# Altium project VI High Side Reference Design.PrjPcb
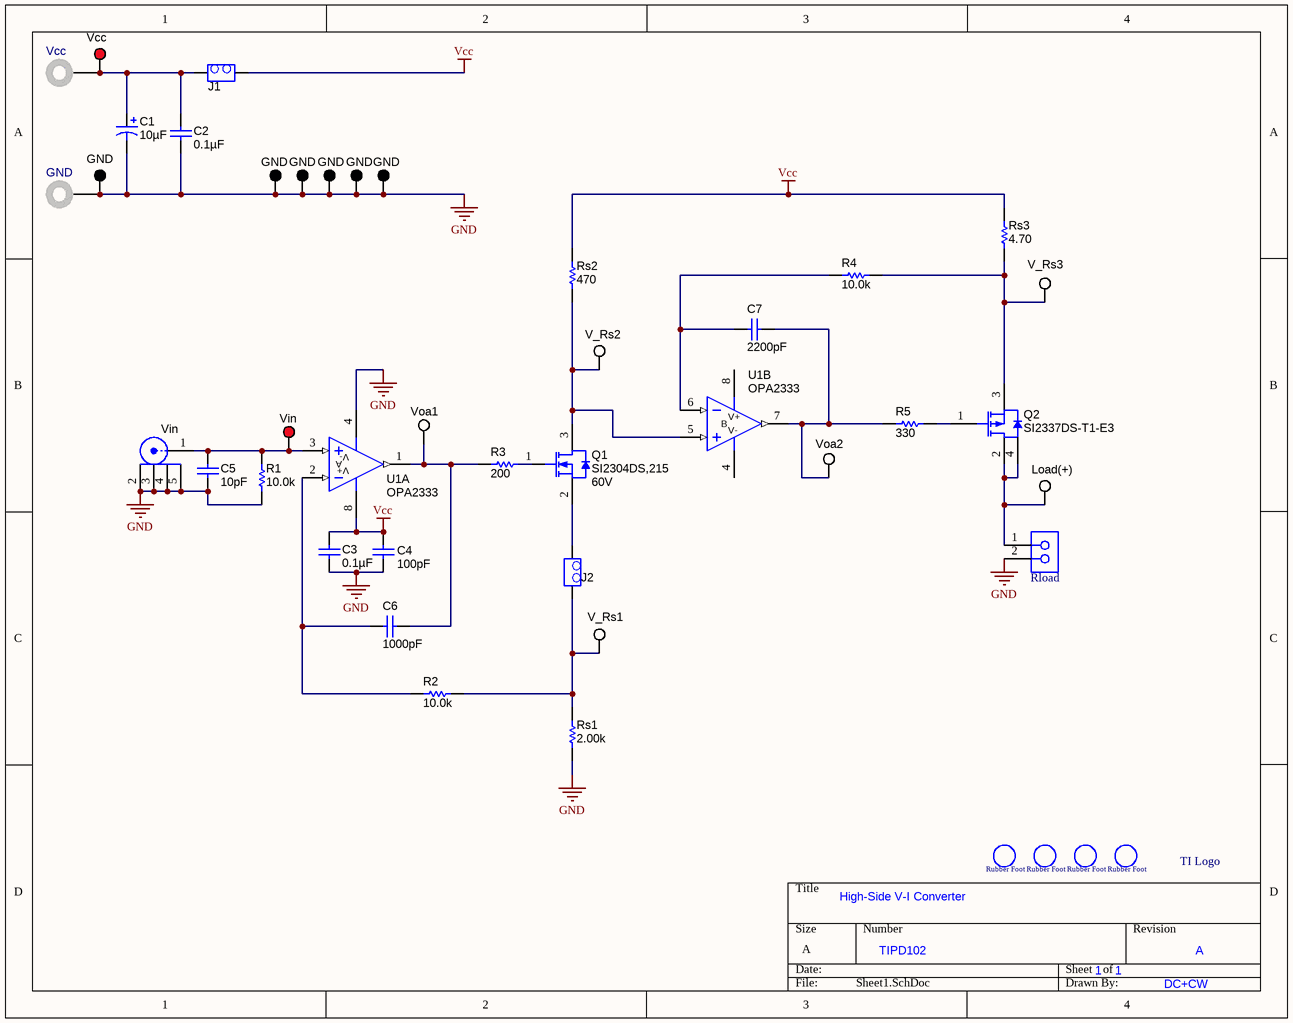
[diagram p0: Sheet1.SchDoc]
1 sheet, 43 parts. Net scope: global (net labels, ports and power ports of the same name join across sheets).
Board file: PCB2.PcbDoc

## Sheet Sheet1.SchDoc: High-Side V-I Converter
size A

### Parts
C1  ValueDisplayed: 10µF  [7343-43]  (hidden comment: TPSE106K050R0400)
C2  ValueDisplayed: 0.1µF  [0603]  (hidden comment: GRM188R72A104KA35D)
C3  ValueDisplayed: 0.1µF  [0603]  (hidden comment: GRM188R72A104KA35D)
C4  ValueDisplayed: 100pF  [0603]  (hidden comment: C1608C0G2A101J)
C5  ValueDisplayed: 10pF  [0603]  (hidden comment: 06035A100JAT2A)
C6  ValueDisplayed: 1000pF  [0603]  (hidden comment: 06031C102JAT2A)
C7  ValueDisplayed: 2200pF  [0603]  (hidden comment: C1608C0G1H222J)
F1  (no value)  [Rubber_Foot]  (no BOM)
F2  (no value)  [Rubber_Foot]  (no BOM)
F3  (no value)  [Rubber_Foot]  (no BOM)
F4  (no value)  [Rubber_Foot]  (no BOM)
GND  575-4  [Keystone_575-4]  (value not drawn)
H1  Vin  [Johnson_142-0701-20x]
J1  TSM-102-01-T-SV  (value not drawn)
J2  TSM-102-01-T-SV  (value not drawn)
Q1  SI2304DS,215  value 60V  [SOT-23]
Q2  SI2337DS-T1-E3  [MP04A_N]
R1  value 10.0k  [0603]  (hidden comment: RG1608P-103-B-T5)
R2  value 10.0k  [0603]  (hidden comment: CRCW060310K0FKEA)
R3  value 200  [0603]  (hidden comment: CRCW0603200RFKEA)
R4  value 10.0k  [0603]  (hidden comment: CRCW060310K0FKEA)
R5  value 330  [0603]  (hidden comment: RC0603FR-07330RL)
Rload  1715721  [PhoenixContact_1715721]  (value not drawn)
Rs1  value 2.00k  [0603]  (hidden comment: RG1608P-202-B-T5)
Rs2  value 470  [0603]  (hidden comment: RGH1608-2C-P-471-B)
Rs3  value 4.70  [0603]  (hidden comment: 8-1614882-3)
TI1  Texas Instruments logo  [TI LOGO]  (value not drawn)
TP1  Vcc  [Keystone5000]
TP2  GND  [Keystone5001]
TP3  GND  [Keystone5001]
TP4  GND  [Keystone5001]
TP5  GND  [Keystone5001]
TP6  GND  [Keystone5001]
TP7  GND  [Keystone5001]
TP8  Vin  [Keystone5000]
TP9  Voa1  [Keystone5002]
TP10  V_Rs2  [Keystone5002]
TP11  V_Rs1  [Keystone5002]
TP12  Voa2  [Keystone5002]
TP13  V_Rs3  [Keystone5002]
TP14  Load(+)  [Keystone5002]
U1  OPA2333  [M08A_L]  (parts A,B of 2)
Vcc  575-4  [Keystone_575-4]  (value not drawn)

### Nets
GND: C1.2(-) C2.2 C3.2 C4.2 C5.2 GND.1 H1.2 H1.3 H1.4 H1.5 R1.1 Rload.2 Rs1.1 TP2.1 TP3.1 TP4.1 TP5.1 TP6.1 TP7.1 U1.4(V-)
Vcc: C3.1 C4.1 J1.2 Rs2.2 Rs3.2 U1.8(V+)
NetC1_1: C1.1(+) C2.1 J1.1 TP1.1 Vcc.1
NetC5_1: C5.1 H1.1 R1.2 TP8.1 U1.3(IN+)
NetC6_1: C6.1 R3.1 TP9.1 U1.1(OUT)
NetC6_2: C6.2 R2.1 U1.2(IN-)
NetC7_1: C7.1 R5.1 TP12.1 U1.7(OUT)
NetC7_2: C7.2 R4.1 U1.6(IN-)
NetJ2_1: J2.1 Q1.2(S)
NetJ2_2: J2.2 R2.2 Rs1.2 TP11.1
NetQ1_1: Q1.1(G) R3.2
NetQ1_3: Q1.3(D) Rs2.1 TP10.1 U1.5(IN+)
NetQ2_1: Q2.1(G) R5.2
NetQ2_2: Q2.2(D) Q2.4(D) Rload.1 TP14.1
NetQ2_3: Q2.3(S) R4.2 Rs3.1 TP13.1

### Notes on the sheet
- (near F1) High-Side V-I Converter
- TIPD102
- 1
- A
- DC+CW
- (in symbol LM6142AIM, part A) A
- (in symbol LM6142AIM, part B) B
- (in symbol SJ61A1) Rubber Foot
- (in symbol TI LOGO) TI Logo

### Library data of the parts
C1 = TPSE106K050R0400: CAP, TANT, 10uF, 50V, +/-10%, 0.4 ohm, 7343-43 SMD; Manufacturer: AVX; Polarized: Y; CompType: Capacitor; U/M: EA; Cap_F: 0.00001; Tolerance_%: 10; Value1: 0.4 ohm; VDC_V: 50; ESR_Ohm: 0.4; IRMS_A: 0.578; TaMin_C: -55; TaMax_C: 125; Cap_Case: E; SymbolVersion: 2008-07-09; Value: 10uF; PartNumber: TPSE106K050R0400; PackageReference: 7343-43; RoHS: Y; Value2: 50V; MountType: SMT; Technology: TA; Series: TPS; Published: 2008-06-19; Publisher: Texas Instruments; LatestRevisionDate: 2012-04-11; LatestRevisionNote: Changed Publisher; ComponentLink1Description: Datasheet link; ComponentLink1URL: http://www.avx.com/docs/masterpubs/tantniob.pdf; Alternate PartNumber: -; Alternate Manufacturer: -; Supplier 1: Digi-Key; Supplier Part Number 1: 478-3361-1-ND; Supplier 2: Farnell; Supplier Part Number 2: 1658990; Supplier 3: Newark; Supplier Part Number 3: 75M2975
C2 C3 = GRM188R72A104KA35D: CAP, CERM, 0.1uF, 100V, +/-10%, X7R, 0603; Manufacturer: MuRata; Polarized: N; CompType: Capacitor; U/M: EA; Cap_F: 0.0000001; Tolerance_%: 10; VDC_V: 100; TaMin_C: -55; TaMax_C: 125; SymbolVersion: 2008-07-09; Value: 0.1uF; PartNumber: GRM188R72A104KA35D; PackageReference: 0603; RoHS: Y; Value1: ?; Value2: 100V; MountType: SMT; Technology: Ceramic; TempCo: X7R; Cap_Case: 0603; Published: 2008-06-19; Publisher: Texas Instruments; LatestRevisionDate: 2012-04-11; LatestRevisionNote: Changed publisher; ComponentLink1Description: Datasheet link; ComponentLink1URL: http://search.murata.co.jp/Ceramy/PnsearchViewAction.do?HnOFG=ON&HnNFG=ON&SEL_CNT=50&sLang=en&sKey=GRM188R72A104KA35D&x=9&y=9&search=startwith; Alternate PartNumber: -; Alternate Manufacturer: -; Supplier 1: Digi-Key; Supplier Part Number 1: 490-3285-1-ND
C4 = C1608C0G2A101J: CAP, CERM, 100pF, 100V, +/-5%, C0G/NP0, 0603; Manufacturer: TDK; Polarized: N; CompType: Capacitor; U/M: EA; Cap_F: 0.0000000001; Tolerance_%: 5; ESR_Ohm: 0.1202; Value1: 0.1202 ohm; VDC_V: 100; TaMin_C: -55; TaMax_C: 125; SymbolVersion: 2008-07-09; Value: 100pF; PartNumber: C1608C0G2A101J; PackageReference: 0603; RoHS: Y; Value2: 100V; MountType: SMT; Technology: Ceramic; TempCo: C0G/NP0; Cap_Case: 0603; Published: 2008-06-19; Publisher: Texas Instruments; LatestRevisionDate: 2012-04-11; LatestRevisionNote: Changed publisher; ComponentLink1Description: Datasheet link; ComponentLink1URL: http://www.tdk.co.jp/tefe02/e412_c.pdf; Alternate PartNumber: -; Alternate Manufacturer: -; Supplier 1: Digi-Key; Supplier Part Number 1: 445-2306-1-ND; Supplier 2: Arrow; Supplier Part Number 2: C1608C0G2A101J
C5 = 06035A100JAT2A: CAP, CERM, 10pF, 50V, +/-5%, C0G/NP0, 0603; Manufacturer: AVX; Polarized: N; CompType: Capacitor; U/M: EA; Cap_F: 0.00000000001; Tolerance_%: 5; ESR_Ohm: 0.403; Value1: 0.403 ohm; VDC_V: 50; TaMin_C: -55; TaMax_C: 125; SymbolVersion: 2008-07-09; Value: 10pF; PartNumber: 06035A100JAT2A; PackageReference: 0603; RoHS: Y; Value2: 50V; MountType: SMT; Technology: Ceramic; TempCo: C0G/NP0; Cap_Case: 0603; Published: 2008-06-19; Publisher: Texas Instruments; LatestRevisionDate: 2012-04-11; LatestRevisionNote: Changed publisher; ComponentLink1Description: Datasheet link; ComponentLink1URL: http://www.avx.com/docs/masterpubs/smccp.pdf; Alternate PartNumber: -; Alternate Manufacturer: -; Supplier 1: Digi-Key; Supplier Part Number 1: 478-1163-1-ND; Supplier 2: Farnell; Supplier Part Number 2: 499110; Supplier 3: Newark; Supplier Part Number 3: 17C6435
C6 = 06031C102JAT2A: CAP, CERM, 1000pF, 100V, +/-5%, X7R, 0603; Manufacturer: AVX; Polarized: N; CompType: Capacitor; U/M: EA; Cap_F: 0.000000001; Tolerance_%: 5; ESR_Ohm: 0.276; Value1: 0.276 ohm; VDC_V: 100; TaMin_C: -55; TaMax_C: 125; SymbolVersion: 2008-07-09; Value: 1000pF; PartNumber: 06031C102JAT2A; PackageReference: 0603; RoHS: Y; Value2: 100V; MountType: SMT; Technology: Ceramic; TempCo: X7R; Cap_Case: 0603; Published: 2008-06-19; Publisher: Texas Instruments; LatestRevisionDate: 2012-04-11; LatestRevisionNote: Changed publisher; ComponentLink1Description: Datasheet link; ComponentLink1URL: http://www.avx.com/docs/masterpubs/smccp.pdf; Alternate PartNumber: -; Alternate Manufacturer: -; Supplier 1: Digi-Key; Supplier Part Number 1: 478-3698-1-ND; Supplier 2: Farnell; Supplier Part Number 2: 1396446; Supplier 3: Newark; Supplier Part Number 3: 96M1234
C7 = C1608C0G1H222J: CAP, CERM, 2200pF, 50V, +/-5%, C0G/NP0, 0603; Manufacturer: TDK; Polarized: N; CompType: Capacitor; U/M: EA; Cap_F: 0.0000000022; Tolerance_%: 5; ESR_Ohm: 0.0375; Value1: 0.0375 ohm; VDC_V: 50; TaMin_C: -55; TaMax_C: 125; SymbolVersion: 2008-07-09; Value: 2200pF; PartNumber: C1608C0G1H222J; PackageReference: 0603; RoHS: Y; Value2: 50V; MountType: SMT; Technology: Ceramic; TempCo: C0G/NP0; Cap_Case: 0603; Published: 2008-06-19; Publisher: Texas Instruments; LatestRevisionDate: 2012-05-14; LatestRevisionNote: Changed publisher; ComponentLink1Description: Datasheet link; ComponentLink1URL: http://www.tdk.co.jp/tefe02/e412_c.pdf; Alternate PartNumber: -; Alternate Manufacturer: -; Supplier 1: Digi-Key; Supplier Part Number 1: 445-1297-1-ND; Supplier 2: Arrow; Supplier Part Number 2: C1608C0G1H222J
F1-F4 = SJ61A1: BUMPON CYLINDRICAL .312X.200 BLK; Manufacturer: 3M; CompType: Rubber Mounting Feet; SymbolCreator: use LDAP id; U/M: EA, IN, or GM; Supplier 1: Digi-Key; Supplier Part Number 1: SJ5746-0-ND; ComponentLink1Description: Datasheet Link; ComponentLink1URL: http://media.digikey.com/pdf/Data%20Sheets/3M%20PDFs/SJ61A1.pdf; MountType: Adhesive - Rubber; PackageReference: *; RoHS: N/A; SymbolVersion: 2012-11-20
GND Vcc = 575-4: Standard Banana Jack, Uninsulated, 5.5mm; Manufacturer: Keystone; CompType: Connector; U/M: EA; PartNumber: 575-4; RoHS: Y; PackageReference: Keystone_575-4; MountType: TH; ComponentLink1Description: Datasheet Link; ComponentLink1URL: http://www.keyelco.com/pdfs/M55p95.pdf; Publisher: National Semiconductor; LatestRevisionDate: 2012-03-04; LatestRevisionNote: Removed DigiKeyPartNumber parameter.; Alternate Manufacturer: -; Alternate PartNumber: -; Supplier 1: Digi-Key; Supplier Part Number 1: 575-4K-ND
H1 = 142-0701-201: Connector, TH, SMA; Manufacturer: Emerson Network Power; U/M: EA; PartNumber: 142-0701-201; CompType: Connector; RoHS: Y; PackageReference: SMA; MountType: TH; ComponentLink1Description: Datasheet Link; ComponentLink1URL: https://emersonconnectivity.com/OA_MEDIA/specs/pi-1420701201.pdf; Publisher: National Semiconductor; LatestRevisionDate: 2012-03-04; LatestRevisionNote: Removed DigiKeyPartNumber parameter.; Alternate Manufacturer: -; Alternate PartNumber: -; Supplier 1: Digi-Key; Supplier Part Number 1: J500-ND
J1 J2 = TSM-102-01-T-SV: CONN HEADER 2POS .100" SNGL SMD; Manufacturer: Samtec; SymbolVersion: use current date i.e. 2008-05-20; SymbolCreator: Use LDAP id; U/M: EA, IN, or GM; MountType: SMT; RoHS: Used in BOM report.  Use Y or N.; PartNumber: TSM-102-01-T-SV; PackageReference: eg:  0603, used in PnP report; ComponentLink1Description: Datasheet Link; ComponentLink1URL: http://www.samtec.com/documents/webfiles/pdf/TSM.PDF; CompType: Header; Alternate PartNumber: -; Alternate Manufacturer: -; Supplier Part Number 1: TSM-102-01-T-SV-ND
Q1 = SI2316BDS-T1-E3: MOSFET, N-CH, 30V, 4.5A, SOT-23; PartNumber: NTF2955T1G; Manufacturer: ON Semi; U/M: EA; ChType: N; Rdson45_Ohm: 0.08; QgTyp_nC: 3.16; IdsMax_A: 4.5; SymbolVersion: 2008-07-28; CompType: MOSFET; PackageReference: SOT-23; RoHS: Y; MountType: SMT; Published: 2008-06-19; LatestRevisionDate: 2012-01-04; LatestRevisionNote: Added parts.; ComponentLink1Description: Datasheet link; Alternate PartNumber: -; Alternate Manufacturer: -; Supplier Part Number 1: NTF2955T1GOSCT-ND
Q2 = SI2337DS-T1-E3: MOSFET, P-CH, -80V, -1.2A, SOT-23; Manufacturer: Vishay-Siliconix; U/M: EA; ChType: P; VdsMax_V: -80; Value1: ? ohm; Value2: 11 nC; QgTyp_nC: 11; Vgs_V: -20; IdsMax_A: -1.2; SymbolVersion: 2008-07-09; Value: -80V; PartNumber: SI2337DS-T1-E3; PackageReference: SOT-23; CompType: MOSFET; RoHS: Y; MountType: SMT; Published: 2008-06-19; Publisher: Texas Instruments; LatestRevisionDate: 2012-01-04; LatestRevisionNote: Added parts.; ComponentLink1Description: Datasheet link; ComponentLink1URL: http://www.vishay.com/docs/73533/si2337ds.pdf; Alternate PartNumber: -; Alternate Manufacturer: -; Supplier 1: Digi-Key; Supplier Part Number 1: SI2337DS-T1-E3CT-ND; Supplier 2: Arrow; Supplier Part Number 2: SI2337DS-T1-E3
R1 = RG1608P-103-B-T5: RES, 10.0k ohm, 0.1%, 0.1W, 0603; Manufacturer: Susumu Co Ltd; CompType: Resistor; Res_ohm: 10000; Value_Code: 10k0; Tolerance_%: 0.1; VDC_V: 75; TempCo: 25 ppm/C; EIA_Code: E192; U/M: EA; SymbolVersion: 2009-05-29; PartNumber: RG1608P-103-B-T5; PackageReference: 0603; RoHS: Y; Value1: 0.1%; Power_W: 0.1; Value2: 0.1W; MountType: SMT; Technology: Metal Film; Published: 2008-06-26; Publisher: Texas Instruments; LatestRevisionDate: 2012-04-20; LatestRevisionNote: Changed publisher; ComponentLink1Description: Datasheet link; ComponentLink1URL: http://www.susumu.co.jp/english/pdf/products-j01-01.pdf; Alternate PartNumber: -; Alternate Manufacturer: -; Supplier 1: Digi-Key; Supplier Part Number 1: RG16P10.0KBCT-ND
R2 R4 = CRCW060310K0FKEA: RES, 10.0k ohm, 1%, 0.1W, 0603; Manufacturer: Vishay-Dale; CompType: Resistor; Res_ohm: 10000; Value_Code: 10k0; Tolerance_%: 1; Power_W: 0.1; VDC_V: 75; TempCo: 100 ppm/C; EIA_Code: E96; U/M: EA; SymbolVersion: 2009-05-29; PartNumber: CRCW060310K0FKEA; PackageReference: 0603; RoHS: Y; Value1: 1%; Value2: 0.1W; MountType: SMT; Technology: Thick Film; Published: 2008-06-26; Publisher: Texas Instruments; LatestRevisionDate: 2012-04-20; LatestRevisionNote: Changed publisher; ComponentLink1Description: Datasheet link; ComponentLink1URL: http://www.vishay.com/docs/20035/dcrcwe3.pdf; Alternate PartNumber: -; Alternate Manufacturer: -; Supplier 1: Digi-Key; Supplier Part Number 1: 541-10.0KHCT-ND; Supplier 2: Farnell; Supplier Part Number 2: 1151638; Supplier 3: Newark; Supplier Part Number 3: 52K8062
R3 = CRCW0603200RFKEA: RES, 200 ohm, 1%, 0.1W, 0603; Manufacturer: Vishay-Dale; CompType: Resistor; Value_Code: 200R; Tolerance_%: 1; Power_W: 0.1; VDC_V: 75; TempCo: 100 ppm/C; EIA_Code: E96; U/M: EA; SymbolVersion: 2009-05-29; PartNumber: CRCW0603200RFKEA; PackageReference: 0603; RoHS: Y; Res_ohm: 200; Value1: 1%; Value2: 0.1W; MountType: SMT; Technology: Thick Film; Published: 2008-06-26; Publisher: Texas Instruments; LatestRevisionDate: 2012-04-20; LatestRevisionNote: Changed publisher; ComponentLink1Description: Datasheet link; ComponentLink1URL: http://www.vishay.com/docs/20035/dcrcwe3.pdf; Alternate PartNumber: -; Alternate Manufacturer: -; Supplier 1: Digi-Key; Supplier Part Number 1: 541-200HCT-ND; Supplier 2: Farnell; Supplier Part Number 2: 1151817; Supplier 3: Newark; Supplier Part Number 3: 52K8273
R5 = RC0603FR-07330RL: RES, 330 ohm, 1%, 0.1W, 0603; Manufacturer: Yageo America; CompType: Resistor; Value_Code: 330R; Tolerance_%: 1; Power_W: 0.1; VDC_V: 150; TempCo: 200 ppm/C; U/M: EA; SymbolVersion: 2009-05-29; PartNumber: RC0603FR-07330RL; PackageReference: 0603; RoHS: Y; Res_ohm: 330; Value1: 1%; Value2: 0.1W; MountType: SMT; Technology: Thick Film; Published: 2008-06-26; Publisher: Texas Instruments; LatestRevisionDate: 2012-04-20; LatestRevisionNote: Changed publisher; ComponentLink1Description: Datasheet link; ComponentLink1URL: http://www.yageo.com/pdf/Pu-RC0603_51_PbFree_L_2.pdf; Alternate PartNumber: -; Alternate Manufacturer: -; Supplier 1: Digi-Key; Supplier Part Number 1: 311-330HRCT-ND
Rload = 1715721: Conn Term Block, 2POS, 5.08mm PCB; Manufacturer: Phoenix Contact; CompType: Terminal Block; U/M: EA; Value: 2x1; SymbolVersion: 2010-10-20; PartNumber: 1715721; RoHS: Y; PackageReference: PhoenixContact_1715721; MountType: TH; ComponentLink1Description: Datasheet Link; ComponentLink1URL: http://eshop.phoenixcontact.com/phoenix/pdf.do?UID=1715721&general=usen; Publisher: National Semiconductor; LatestRevisionDate: 2012-03-04; LatestRevisionNote: Removed DigiKeyPartNumber parameter.; Alternate Manufacturer: -; Alternate PartNumber: -; Supplier 1: Digi-Key; Supplier Part Number 1: 277-1263-ND
Rs1 = RG1608P-202-B-T5: RES, 2.00k ohm, 0.1%, 0.1W, 0603; Manufacturer: Susumu Co Ltd; CompType: Resistor; Res_ohm: 2000; Value_Code: 2k00; Tolerance_%: 0.1; VDC_V: 75; TempCo: 25 ppm/C; EIA_Code: E192; U/M: EA; SymbolVersion: 2009-05-29; PartNumber: RG1608P-202-B-T5; PackageReference: 0603; RoHS: Y; Value1: 0.1%; Power_W: 0.1; Value2: 0.1W; MountType: SMT; Technology: Metal Film; Published: 2008-06-26; Publisher: Texas Instruments; LatestRevisionDate: 2012-04-20; LatestRevisionNote: Changed publisher; ComponentLink1Description: Datasheet link; ComponentLink1URL: http://www.susumu.co.jp/english/pdf/products-j01-01.pdf; Alternate PartNumber: -; Alternate Manufacturer: -; Supplier 1: Digi-Key; Supplier Part Number 1: RG16P2.0KBCT-ND
Rs2 = RG1608P-101-B-T5: RES 470 OHM 1/6W 0.1% 0603; Manufacturer: Susumu Co Ltd; CompType: Resistor; Res_ohm: 100; Value_Code: 470R; Tolerance_%: 0.1; Value2: 0.167W; VDC_V: 75; TempCo: 25 ppm/C; EIA_Code: E192; U/M: EA; SymbolVersion: 2009-05-29; PartNumber: RGH1608-2C-P-471-B; PackageReference: 0603; RoHS: Y; Value1: 0.1%; Power_W: 0.1; MountType: SMT; Technology: Metal Film; Published: 2008-06-26; Publisher: Texas Instruments; LatestRevisionDate: 2012-04-20; LatestRevisionNote: Changed publisher; ComponentLink1Description: Datasheet link; ComponentLink1URL: http://www.susumu.co.jp/english/pdf/products-j01-01.pdf; Alternate PartNumber: -; Alternate Manufacturer: -; Supplier 1: Digi-Key; Supplier Part Number 1: RGH16P470CT-ND
Rs3 = CRCW06031R00FKEA: RES 4.70 OHM 1/16W 0.1% 0603; Manufacturer: TE Connectivity; CompType: Resistor; Res_ohm: 1; Value_Code: 4R70; Tolerance_%: 0.1; Power_W: 0.0625; Value2: 0.0625W; VDC_V: 75; TempCo: 25 ppm/C; EIA_Code: E96; U/M: EA; SymbolVersion: 2009-05-29; PartNumber: 8-1614882-3; PackageReference: 0603; RoHS: Y; Value1: 0.1%; MountType: SMT; Technology: Thick Film; Published: 2008-06-26; Publisher: Texas Instruments; LatestRevisionDate: 2012-04-20; LatestRevisionNote: Changed publisher; ComponentLink1Description: Datasheet link; ComponentLink1URL: http://www.vishay.com/docs/20035/dcrcwe3.pdf; Alternate PartNumber: -; Alternate Manufacturer: -; Supplier 1: Digikey; Supplier Part Number 1: A103106CT-ND
TI1 = TI LOGO: TI BUG
TP1 TP8 = 5000: Test Point, TH, Miniature, Red; Manufacturer: Keystone; CompType: Test Point Loop; U/M: EA; RoHS: Y; DigiKeyPartNumber: 5000K-ND; Value: Red; SymbolVersion: 2008-04-04; PartNumber: 5000; PackageReference: Keystone5000; ComponentLink1Description: Datasheet Link; ComponentLink1URL: http://www.keyelco.com/pdfs/M55p51.pdf; MountType: TH; Publisher: National Semiconductor; LatestRevisionDate: 2012-03-04; LatestRevisionNote: Removed DigiKeyPartNumber parameter.; Alternate Manufacturer: -; Alternate PartNumber: -; Supplier 1: Digi-Key; Supplier Part Number 1: 5000K-ND
TP2-TP7 = 5001: Test Point, TH, Miniature, Black; Manufacturer: Keystone; CompType: Test Point Loop; U/M: EA; RoHS: Y; DigiKeyPartNumber: 5001K-ND; Value: Black; SymbolVersion: 2008-04-04; PartNumber: 5001; PackageReference: Keystone5001; ComponentLink1Description: Datasheet Link; ComponentLink1URL: http://www.keyelco.com/pdfs/M55p51.pdf; MountType: TH; Publisher: National Semiconductor; LatestRevisionDate: 2012-03-04; LatestRevisionNote: Removed DigiKeyPartNumber parameter.; Alternate Manufacturer: -; Alternate PartNumber: -; Supplier 1: Digi-Key; Supplier Part Number 1: 5001K-ND
TP9-TP14 = 5002: Test Point, TH, Miniature, White; Manufacturer: Keystone; CompType: Test Point Loop; U/M: EA; RoHS: Y; DigiKeyPartNumber: 5002K-ND; Value: White; SymbolVersion: 2008-04-04; PartNumber: 5002; PackageReference: Keystone5002; ComponentLink1Description: Datasheet Link; ComponentLink1URL: http://www.keyelco.com/pdfs/M55p51.pdf; MountType: TH; Publisher: National Semiconductor; LatestRevisionDate: 2012-03-04; LatestRevisionNote: Removed DigiKeyPartNumber parameter.; Alternate Manufacturer: -; Alternate PartNumber: -; Supplier 1: Digi-Key; Supplier Part Number 1: 5002K-ND; Supplier 2: Newark; Supplier Part Number 2: 82H9632
U1 = LM6142AIM: 17MHz Rail-to-Rail Input and Output Op Amp; Manufacturer: Texas Instruments; CompType: OpAmp IC; TaMin_C: -40.0; TaMax_C: 85.0; PowerWise: N; SymbolVersion: 2008-07-09; PartNumber: OPA2333; PackageDescription: 8 Lead SOIC; PackageReference: M08A_L; RoHS: O; ComponentLink3Description: M08A Package Web Page; Version: B1.668; LatestRevisionDate: 2011-09-28; LatestRevisionNote: Mass Update; Published: 2011-09-28